# EAGLE schematic v1 (EAGLE 9.6.2)
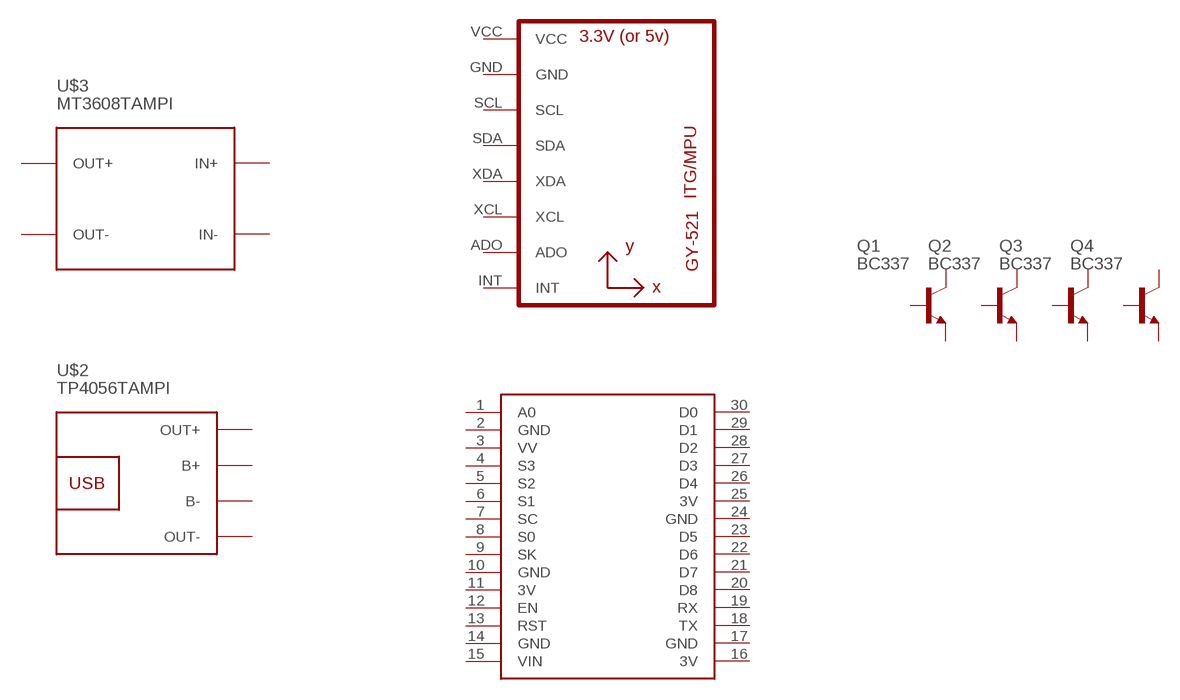
[diagram p0: schematic, sheet 1]

## Parts
Q1  BC337  [TAMPI_BC337]
Q2  BC337  [TAMPI_BC337]
Q3  BC337  [TAMPI_BC337]
Q4  BC337  [TAMPI_BC337]
U1  MPU6050MPU6050  [GY-521]
U$1  NODEMCUTAMPI  [TAMPI_NODEMCU]
U$2  TP4056TAMPI  [TAMPI_TP4056]
U$3  MT3608TAMPI  [TAMPI_MT3608]
Unconnected: Q1.1(E) Q1.2(B) Q1.3(C) Q2.1(E) Q2.2(B) Q2.3(C) Q3.1(E) Q3.2(B) Q3.3(C) Q4.1(E) Q4.2(B) Q4.3(C) U1.ADO U1.GND U1.INT U1.SCL U1.SDA U1.VCC U1.XCL U1.XDA U$1.1(A0) U$1.3(VV) U$1.4(S3) U$1.5(S2) U$1.6(S1) U$1.7(SC) U$1.8(S0) U$1.9(SK) U$1.12(EN) U$1.13(RST) U$1.15(VIN) U$1.18(TX) U$1.19(RX) U$1.20(D8) U$1.21(D7) U$1.22(D6) U$1.23(D5) U$1.26(D4) U$1.27(D3) U$1.28(D2) U$1.29(D1) U$1.30(D0) U$2.B+ U$2.B- U$2.OUT+ U$2.OUT- U$3.IN+ U$3.IN- U$3.OUT+ U$3.OUT-

## Power pins joined to a net without a drawn wire
3V: U$1.11(3V) U$1.16(3V) U$1.25(3V)
GND: U$1.2(GND) U$1.10(GND) U$1.14(GND) U$1.17(GND) U$1.24(GND)

## Library data of the parts
Q1-Q4 = drone:BC337: NPN Transistor
U1 = drone:MPU6050
U$1 = drone:NODEMCU
U$2 = drone:TP4056: Lithium Battery 5V Charger with protection circuit More details available here: http://www.instructables.com/id/DIY-Lithium-ion-Battery-Charger/step4/TP4056-based-lithium-ion-battery-charger-module/ Click here to find device on ebay.com <http://www.ebay.com/sch/tp4056+charger+usb+protection>
U$3 = drone:MT3608: DC/DC Step-Up Regulator based on MT3608 chip MT3608 datasheet available here: https://www.olimex.com/Products/Breadboarding/BB-PWR-3608/resources/MT3608.pdf Click here to find device on ebay.com <http://www.ebay.com/sch/mt3608+module>